# EAGLE schematic EagleTemplate-new (EAGLE 7.7.0)
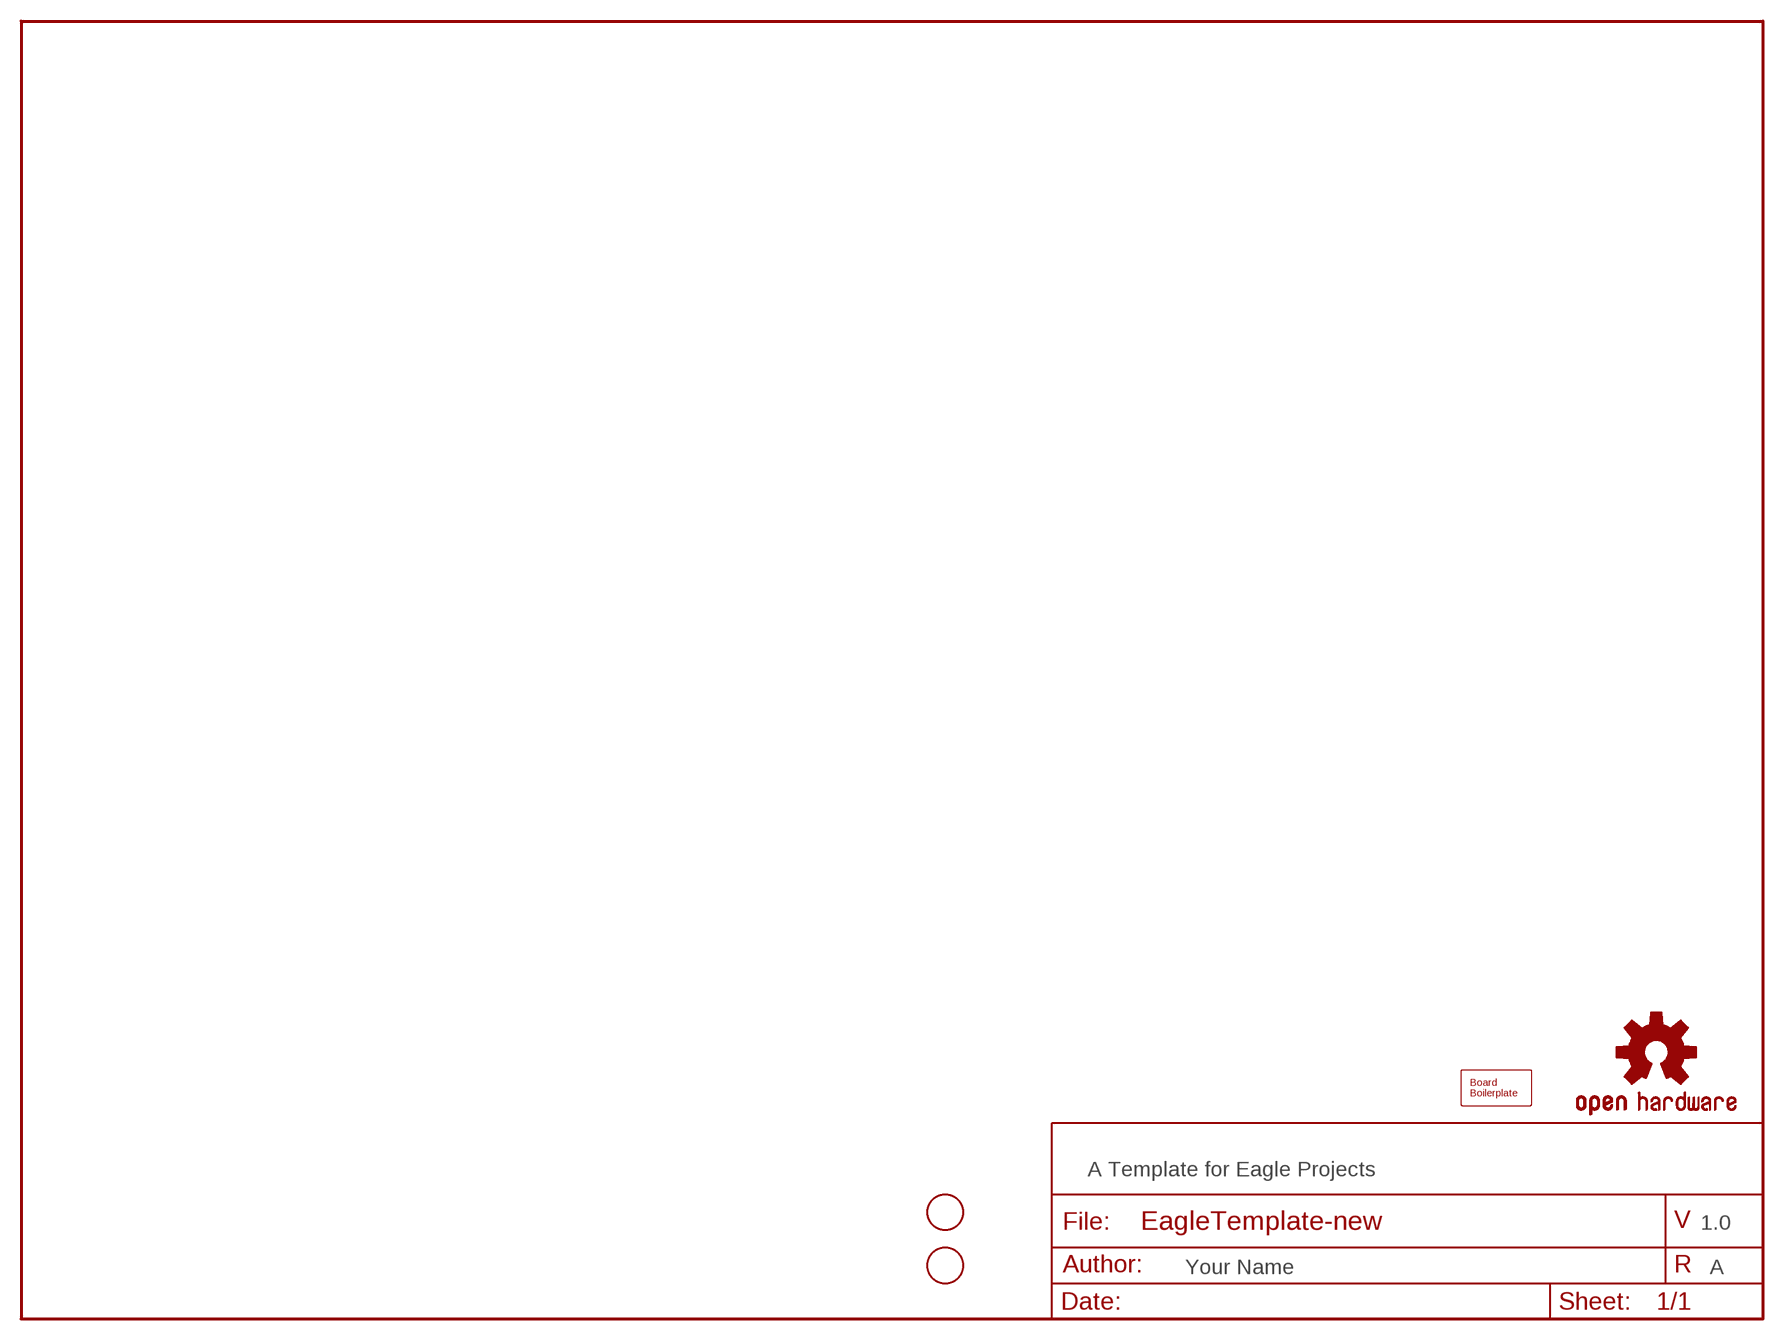
[diagram p0: schematic, sheet 1]

## Parts
BOARD1  BOARD80X100  [BOARD-DINRAIL-3.17INX10CM]
FID1  FIDUCIAL  [FIDUCIAL_1MM]
FID2  FIDUCIAL  [FIDUCIAL_1MM]
OSHW1  DOC-OSHW-LOGO-M  [OSHW-LOGO-M]

## Notes on the sheet
- A Template for Eagle Projects
- 1.0
- Your Name | A

## Library data of the parts
BOARD1 = SPCoast:BOARD
FID1 FID2 = SPCoast:FIDUCIAL: For use by pick and place machines to calibrate the vision/machine, 1mm By microbuilder.eu
OSHW1 = SPCoast:DOC-OSHW-LOGO-: Open Source Hardware Logo This logo indicates the piece of hardware it is found on incorporates a OSHW license and/or adheres to the definition of open source hardware http://freedomdefined.org/OSHW Creative Commons - Attribution - ShareAlike 3.0